# Altium schematic sheet Amp_filter_schematic.SchDoc
size A
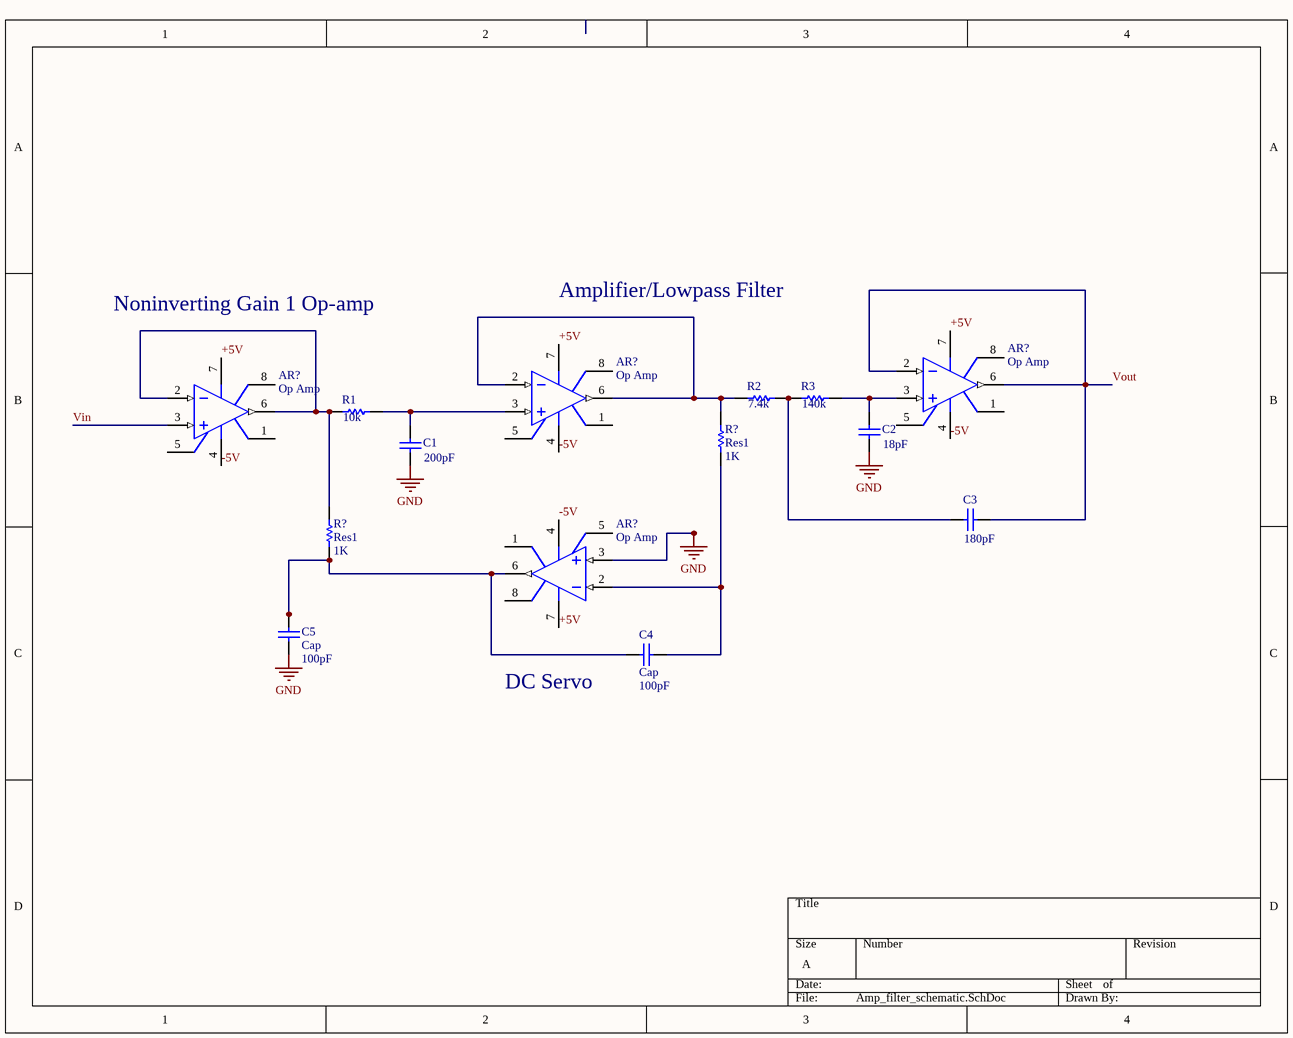
[diagram p0: Amp_filter_schematic.SchDoc]

## Parts
(Parts that share a designator on the sheet are numbered #1, #2 ... from top to bottom, then left to right.)
AR?#1  Op Amp  [H-08A]
AR?#2  Op Amp  [H-08A]
AR?#3  Op Amp  [H-08A]
AR?#4  Op Amp  [H-08A]
C1  value 200pF  [RAD-0.3]
C2  value 18pF  [RAD-0.3]  (hidden comment: Cap)
C3  value 180pF  [RAD-0.3]  (hidden comment: Cap)
C4  Cap  value 100pF  [RAD-0.3]
C5  Cap  value 100pF  [RAD-0.3]
R1  value 10k  [AXIAL-0.3]
R2  value 7.4k  [AXIAL-0.3]  (hidden comment: Res1)
R3  value 140k  [AXIAL-0.3]  (hidden comment: Res1)
R?#1  Res1  value 1K  [AXIAL-0.3]
R?#2  Res1  value 1K  [AXIAL-0.3]

## Nets
GND: AR?#4.3(IN+) C1.2 C2.1 C5.1
+5V: AR?#1.7(V+) AR?#2.7(V+) AR?#3.7(V+) AR?#4.7(V+)
-5V: AR?#1.4(V-) AR?#2.4(V-) AR?#3.4(V-) AR?#4.4(V-)
Vin: AR?#3.3(IN+)
Vout: AR?#1.2(IN-) AR?#1.6(OUT) C3.2
NetAR?#1_3: AR?#1.3(IN+) C2.2 R3.2
NetAR?#2_2: AR?#2.2(IN-) AR?#2.6(OUT) R2.1 R?#1.2
NetAR?#2_3: AR?#2.3(IN+) C1.1 R1.2
NetAR?#3_2: AR?#3.2(IN-) AR?#3.6(OUT) R1.1 R?#2.2
NetAR?#4_2: AR?#4.2(IN-) C4.2 R?#1.1
NetAR?#4_6: AR?#4.6(OUT) C4.1 C5.2 R?#2.1
NetC3_1: C3.1 R2.2 R3.1

Not connected (* = marked no-connect by the designer): AR?#1 1(OS_NUL) 5(OS_NUL) 8(TAB); AR?#2 1(OS_NUL) 5(OS_NUL) 8(TAB); AR?#3 1(OS_NUL) 5(OS_NUL) 8(TAB); AR?#4 1(OS_NUL) 5(OS_NUL) 8(TAB)

## Notes on the sheet
- Noninverting Gain 1 Op-amp
- Amplifier/Lowpass Filter
- DC Servo

## Library data of the parts
AR?#1-AR?#4 = Op Amp: FET Operational Amplifier; Published: 8-Jun-2000; LatestRevisionDate: 17-Jul-2002; LatestRevisionNote: Re-released for DXP Platform.; DatasheetVersion: REV. B; PackageVersion: 1990; PackageReference: H-08A; Publisher: Altium Limited; PackageDescription: Can; 8 Leads; Pin Circle Dia. 5.08 mm; Lead Dia. 0.53 mm (max); ComponentLink1Description: Manufacturer Link; ComponentLink1URL: http://www.analog.com/
C1-C5 = Cap: Capacitor; Published: 8-Jun-2000; LatestRevisionDate: 17-Jul-2002; LatestRevisionNote: Re-released for DXP Platform.; PackageReference: RAD-0.3; Publisher: Altium Limited; PackageDescription: Radial Cap, Thru-Hole; 2 Leads; 0.3 in Pin Spacing
R1-R3 R?#1 R?#2 = Res1: Resistor; Published: 8-Jun-2000; LatestRevisionDate: 17-Jul-2002; LatestRevisionNote: Re-released for DXP Platform.; PackageReference: AXIAL-0.3; Publisher: Altium Limited; PackageDescription: Axial Device, Thru-Hole; 2 Leads; 0.3 in Pin Spacing